# EAGLE schematic magspoof-schematic-dip (EAGLE 7.5.1)
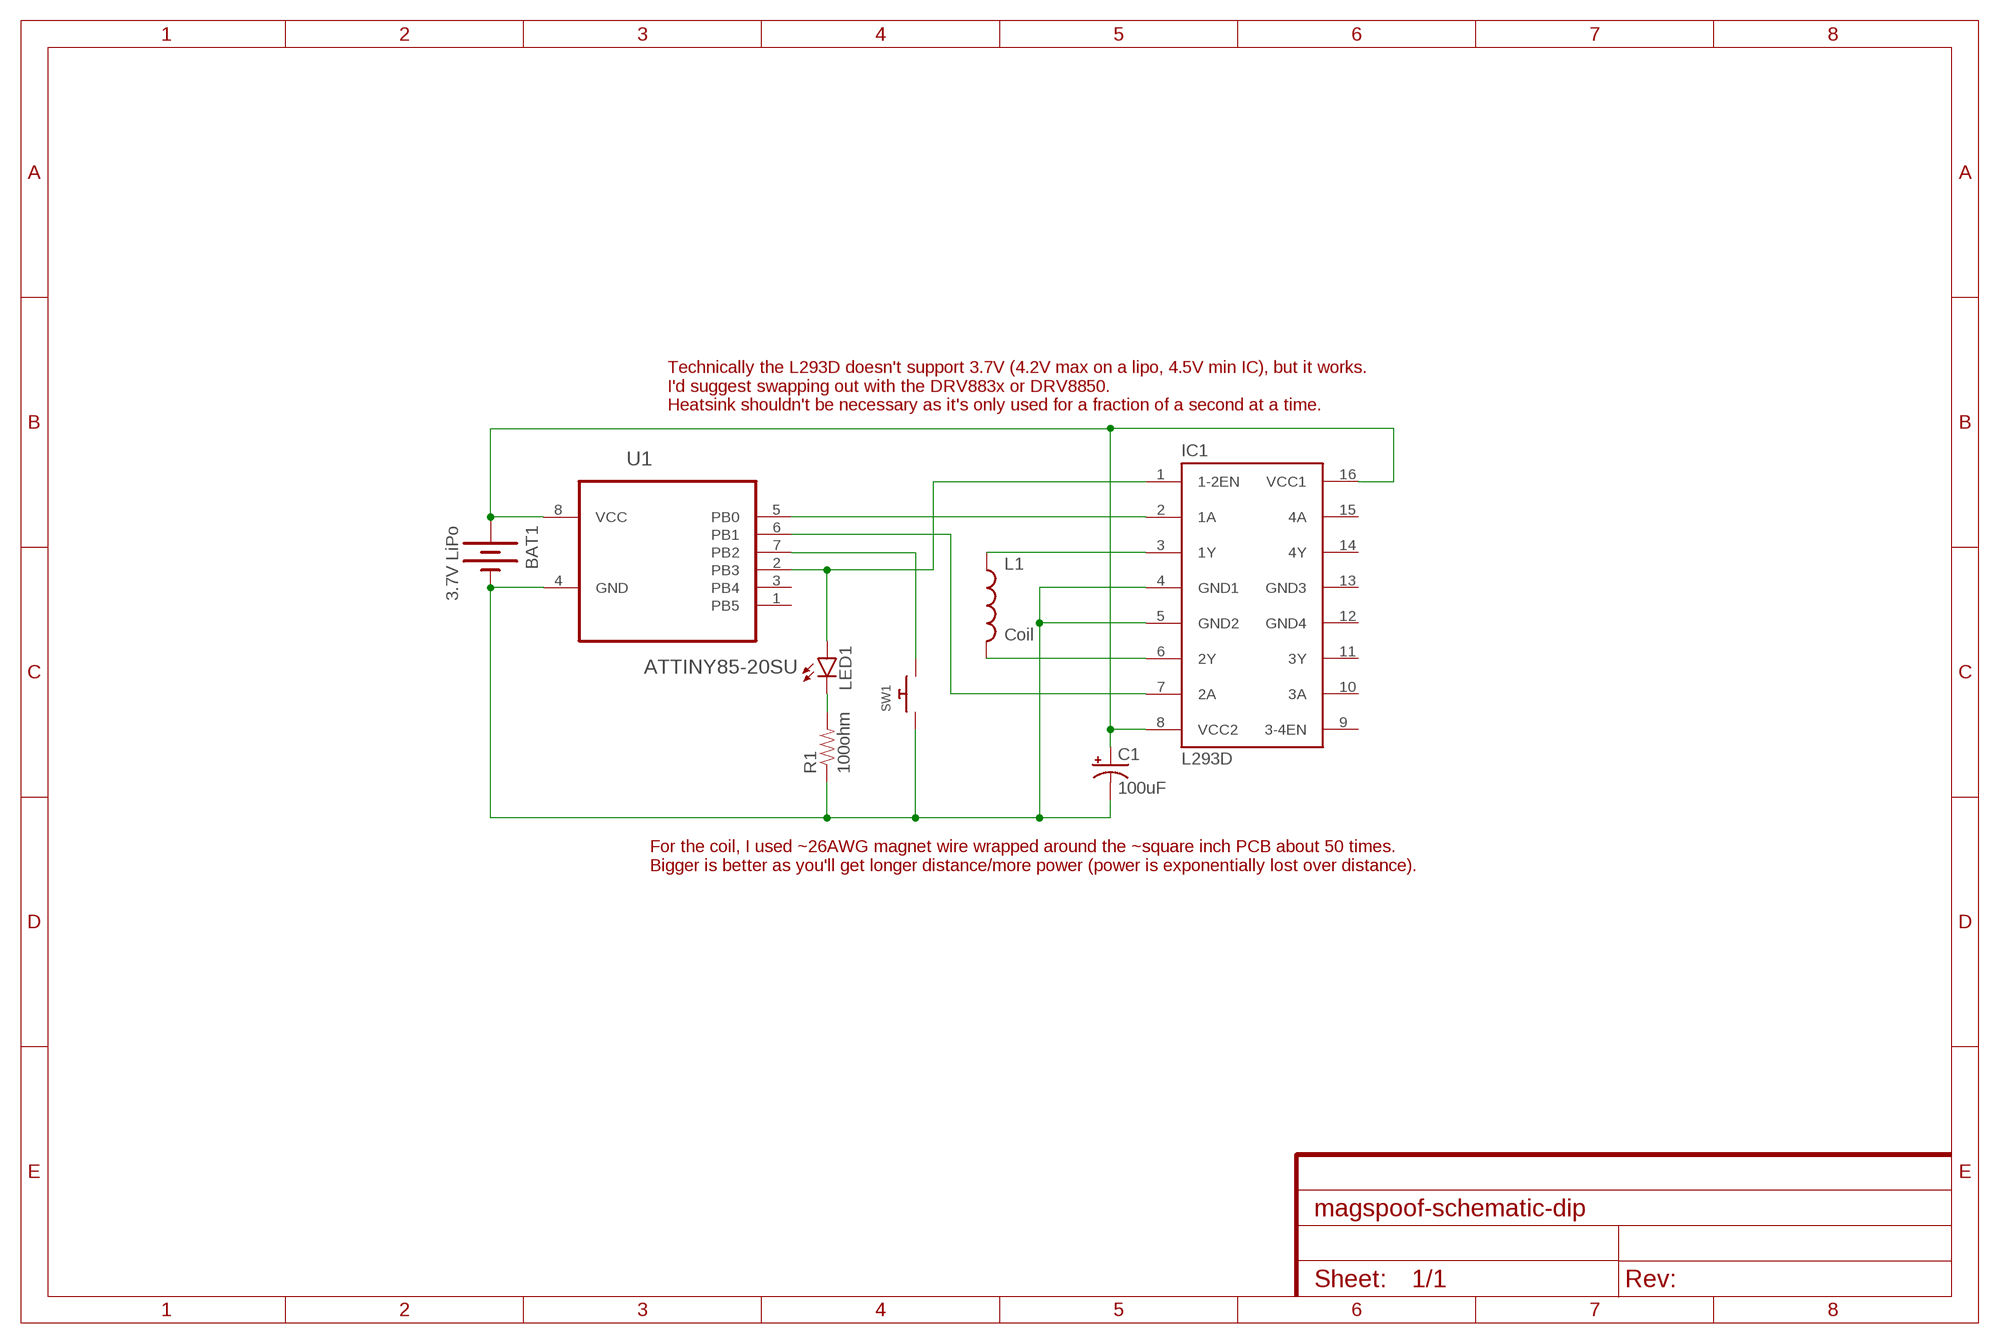
[diagram p0: schematic, sheet 1]
FRAME1 (FRAME-A4L): CNAME: http://samy.pl; DESIGNER: Samy Kamkar

## Parts
BAT1  3.7V LiPo  BATTERYLIPO-TABS  [LIPO-110-TABS]
C1  100uF  CAP_POLPTH1  [CPOL-RADIAL-100UF-25V]
IC1  L293D  [DIL16]
L1  Coil  INDUCTORAXIAL-0.6  [AXIAL-0.6]
LED1  LED-3MM-NO_SILK  [LED3MM-NS]
R1  100ohm  RESISTORAXIAL-0.3  [AXIAL-0.3]
SW1  SWITCH_PUSHBUTTONEVQ-PE  [TACT_PANA-EVQ]
U1  ATTINY85-20SU  [SOIC127P798X216-8N]

## Nets
N$1: IC1.3(1Y) L1.P$1
N$2: IC1.6(2Y) L1.P$2
N$3: IC1.2(1A) U1.5(PB0)
N$4: IC1.7(2A) U1.6(PB1)
N$5: IC1.1(1-2EN) LED1.A U1.2(PB3)
N$7: LED1.K(C) R1.P$2
N$8: SW1.P$2 U1.7(PB2)
N$10: BAT1.- C1.2(-) IC1.4(GND1) IC1.5(GND2) R1.P$1 SW1.P$1 U1.4(GND)
N$14: BAT1.+ C1.1(+) IC1.8(VCC2) IC1.16(VCC1) U1.8(VCC)
Unconnected: IC1.9(3-4EN) IC1.10(3A) IC1.11(3Y) IC1.14(4Y) IC1.15(4A) U1.1(PB5) U1.3(PB4)

## Notes on the sheet
- Technically the L293D doesn't support 3.7V (4.2V max on a lipo, 4.5V min IC), but it works.
  I'd suggest swapping out with the DRV883x or DRV8850.
  Heatsink shouldn't be necessary as it's only used for a fraction of a second at a time.
- For the coil, I used ~26AWG magnet wire wrapped around the ~square inch PCB about 50 times.
  Bigger is better as you'll get longer distance/more power (power is exponentially lost over distance).

## Power pins joined to a net without a drawn wire
GND3: IC1.13(GND3)
GND4: IC1.12(GND4)

## Library data of the parts
BAT1 = SparkFun-Electromechanical:BATTERY: Battery Holders Various common sizes : AA, AAA, 20mm coin cell and 12mm coin cell. 20MM_4LEGS, BATT-10373
C1 = SparkFun-Capacitors:CAP_POL: Capacitor Polarized These are standard SMD and PTH capacitors. Normally 10uF, 47uF, and 100uF in electrolytic and tantalum varieties. Always verify the external diameter of the through hole cap, it varies with capacity, voltage, and manufacturer. The EIA devices should be standard.
IC1 = st-microelectronics:L293D: PUSH-PULL 4 CHANNEL DRIVER; MPN: L293D; OC_FARNELL: 9589619; OC_NEWARK: 56P8249
L1 = SparkFun-Passives:INDUCTOR: Inductors Basic Inductor/Choke - 0603 and 1206. Footprints are not proven and vary greatly between part numbers. SRN6045- 33uH, 20% 1.4A SDR0403-560KL - 56uH, 10%, 500mA RMS/740mA peak
LED1 = SparkFun-LED:LED: LEDs Standard schematic elements and footprints for 5mm, 3mm, 1206, and 0603 sized LEDs. 5mm - Spark Fun Electronics SKU : COM-00529 (and others)
R1 = SparkFun-Passives:RESISTOR: Resistor Basic schematic elements and footprints for 0603, 1206, and PTH resistors.
SW1 = adafruit:SWITCH_PUSHBUTTON: Buttons SOFTTOUCHSMD_SJ - Soft touch temporary push button (Super Junk Akihabara) Compatible with SKPMANE010 [Mouser: 688-SKPMAN] C&K_KSS = Digikey: KSS221GLFS
U1 = Atmel_By_element14_Batch_1-00:ATTINY85-20SU: 8-bit Microcontroller with In-System Programmable Flash; MPN: ATTINY85-20SU; OC_FARNELL: 1455164; OC_NEWARK: 58M3797; PACKAGE: SOIC-8; SUPPLIER: Atmel